# Altium schematic sheet Screen.SchDoc
size A4
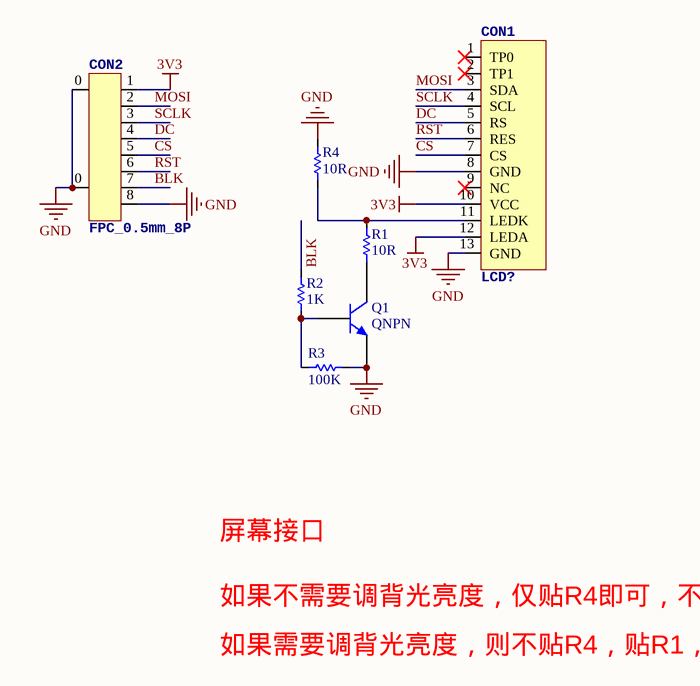
[diagram p0: Screen.SchDoc]

## Parts
CON1  LCD?  [LCD_ST7735]
CON2  FPC_0.5mm_8P  [FFC_0.5_8]
Q1  QNPN  [SOT-23B_N]
R1  10R  [RESC_0402]
R2  1K  [RESC_0402]
R3  100K  [RESC_0402]
R4  10R  [RESC_0402]

## Nets
3V3: CON1.10(VCC) CON1.12(LEDA) CON2.1
GND: CON1.8(GND) CON1.13(GND) CON2.0 CON2.8 Q1.3(E) R3.2 R4.2
BLK: CON2.7 R2.2
CS: CON1.7(CS) CON2.5
DC: CON1.5(RS) CON2.4
MOSI: CON1.3(SDA) CON2.2
RST: CON1.6(RES) CON2.6
SCLK: CON1.4(SCL) CON2.3
NetCON1_11: CON1.11(LEDK) R1.2 R4.1
NetQ1_1: Q1.1(C) R1.1
NetQ1_2: Q1.2(B) R2.1 R3.1

Not connected (* = marked no-connect by the designer): CON1 1(TP0)* 2(TP1)* 9(NC)*

## Notes on the sheet
- 屏幕接口
- 如果不需要调背光亮度，仅贴R4即可，不贴R1，R2,R3，Q1
- 如果需要调背光亮度，则不贴R4，贴R1，R2,R3，Q1

## Library data of the parts
CON1 = LCD_ST7735: 屏幕排线接口
CON2 = FPC_0.5mm_8P: FPC连接器
Q1 = QNPN: NPN Bipolar Transistor; Published: 8-Jun-2000; LatestRevisionDate: 29-May-2009; LatestRevisionNote: IPC-7351 Footprint Added.; PackageVersion: Aug-1999; PackageReference: SOT-23B; Publisher: Altium Limited; PackageDescription: 3-Pin SOT-23 Package 0.95 mm Pitch, 2.4 mm Lead Span
R1-R4 = 电阻-0402: 贴片电阻; Value: 22R